# Altium schematic sheet fscv8ch.SCHDOC: 8 channel voltammetry headstage
size B; Date: 06/2016; Author: schwerdt; CompanyName: mit; : ff; DocumentName: fscv8ch
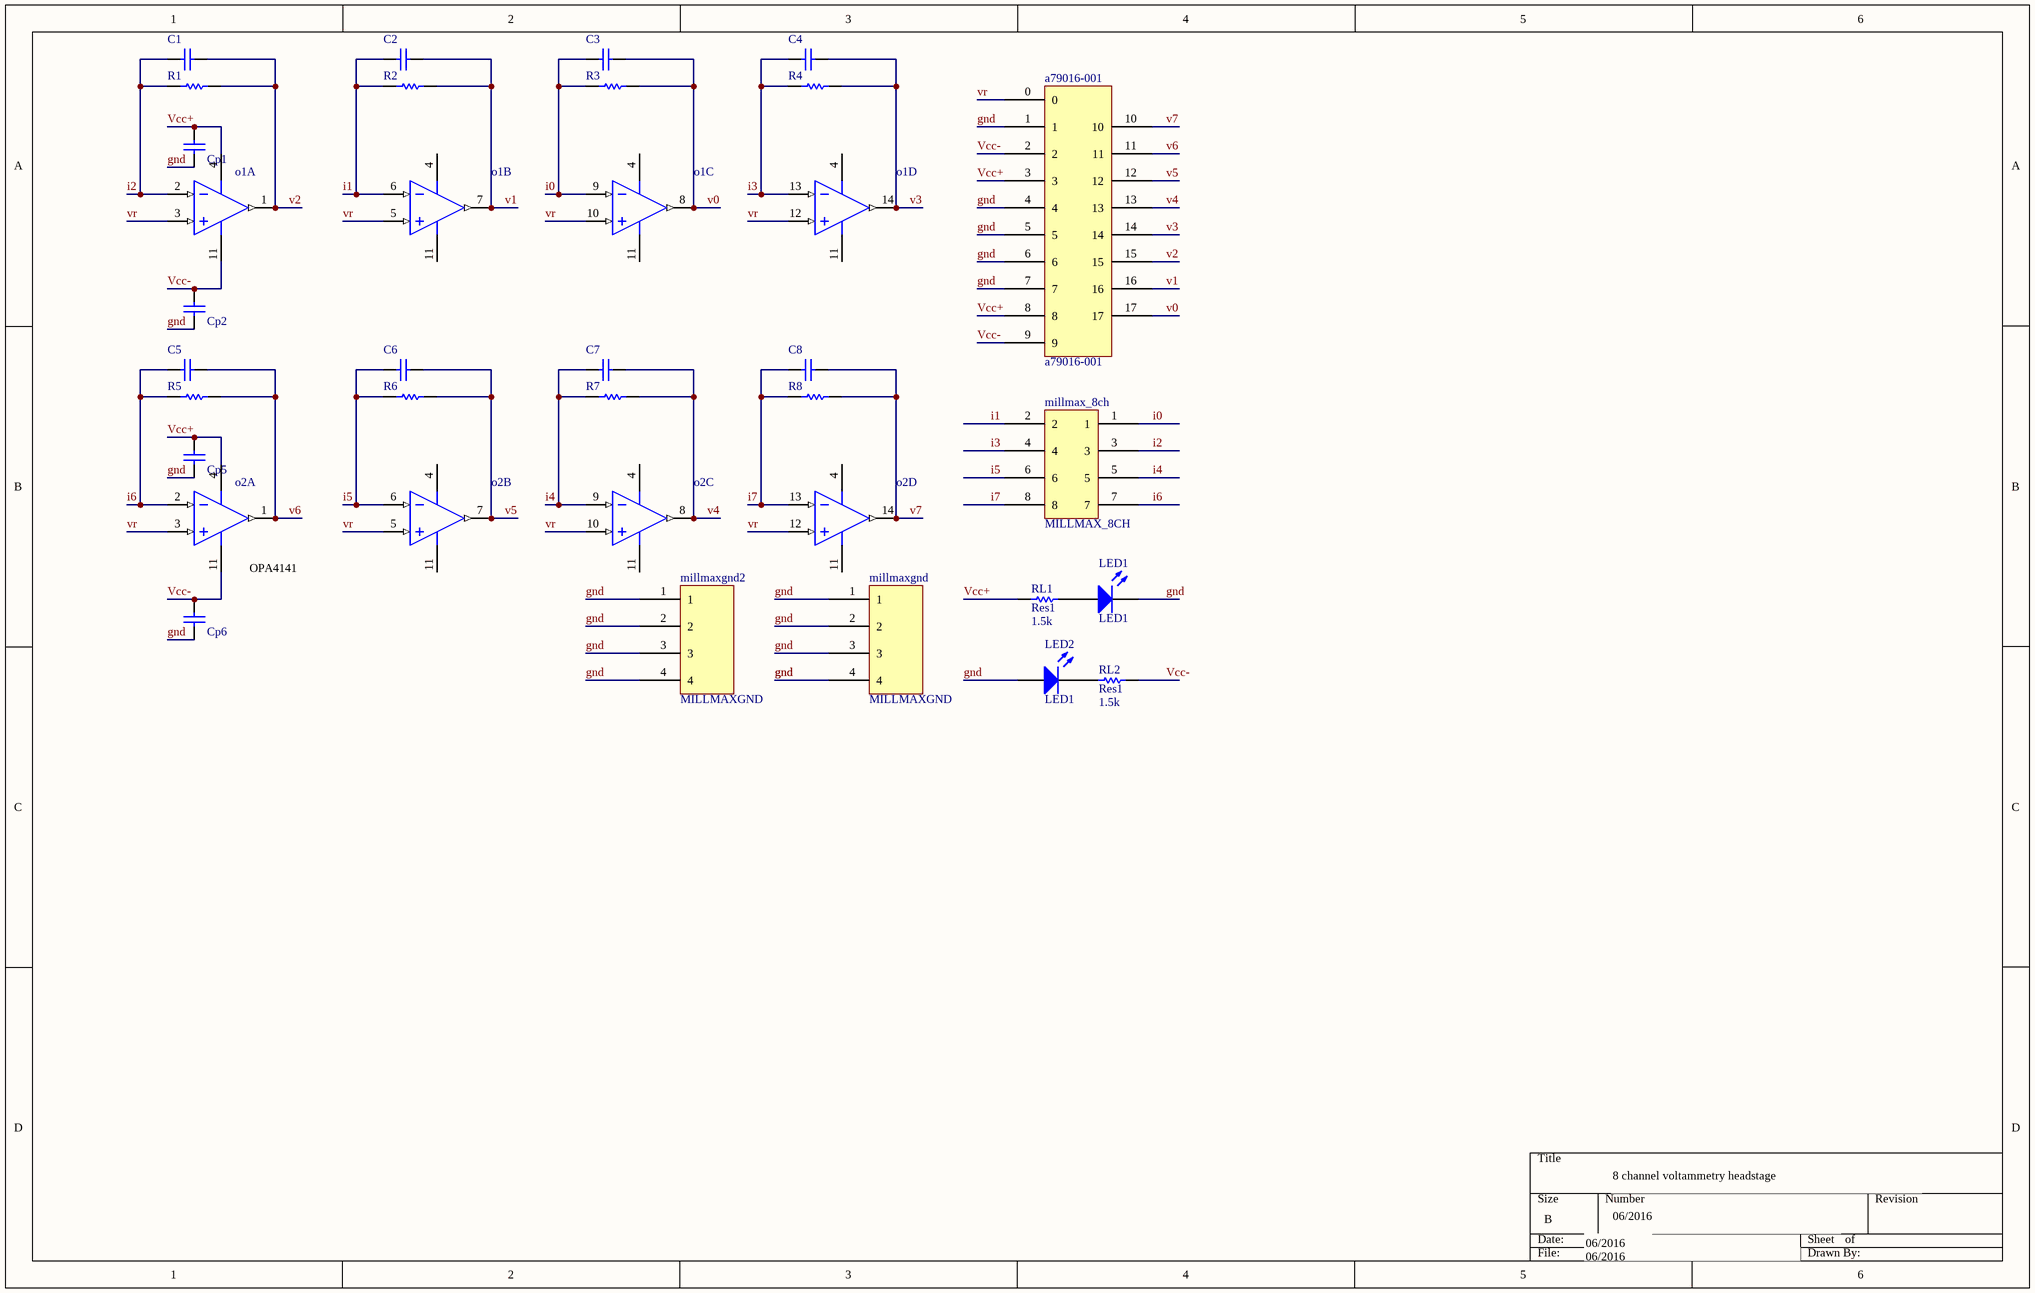
[diagram p0: fscv8ch.SCHDOC]

## Parts
a79016-001  (no value)  [A79016-001_finalnovias]
C1  Cap  [0402]  (value not drawn)
C2  Cap  [0402]  (value not drawn)
C3  Cap  [0402]  (value not drawn)
C4  Cap  [0402]  (value not drawn)
C5  Cap  [0402]  (value not drawn)
C6  Cap  [0402]  (value not drawn)
C7  Cap  [0402]  (value not drawn)
C8  Cap  [0402]  (value not drawn)
Cp1  Cap  [0402]  (value not drawn)
Cp2  Cap  [0402]  (value not drawn)
Cp5  Cap  [0402]  (value not drawn)
Cp6  Cap  [0402]  (value not drawn)
LED1  LED1  [LED_smd]
LED2  LED1  [LED_smd]
millmax_8ch  MILLMAX_8CH  [millmax833-d -8ch]
millmaxgnd  MILLMAXGND  [millmax833-43-008-20-001000gnd]
millmaxgnd2  MILLMAXGND  [millmax833-43-008-20-001000gnd]
o1  TLC274ACD  [SO-G14]  (value not drawn)  (parts A,B,C,D of 4)
o2  TLC274ACD  [SO-G14]  (value not drawn)  (parts A,B,C,D of 4)
R1  Res Semi  [0402]  (value not drawn)
R2  Res Semi  [0402]  (value not drawn)
R3  Res Semi  [0402]  (value not drawn)
R4  Res Semi  [0402]  (value not drawn)
R5  Res Semi  [0402]  (value not drawn)
R6  Res Semi  [0402]  (value not drawn)
R7  Res Semi  [0402]  (value not drawn)
R8  Res Semi  [0402]  (value not drawn)
RL1  Res1  value 1.5k  [0402]
RL2  Res1  value 1.5k  [0402]

## Nets
gnd: a79016-001.1 a79016-001.4 a79016-001.5 a79016-001.6 a79016-001.7 Cp1.1 Cp2.1 Cp5.1 Cp6.1 LED1.2(K) LED2.1(A) millmaxgnd.1 millmaxgnd.2 millmaxgnd.3 millmaxgnd.4 millmaxgnd2.1 millmaxgnd2.2 millmaxgnd2.3 millmaxgnd2.4
i0: C3.1 millmax_8ch.1 o1.9(IN-) R3.1
i1: C2.1 millmax_8ch.2 o1.6(IN-) R2.1
i2: C1.1 millmax_8ch.3 o1.2(IN-) R1.1
i3: C4.1 millmax_8ch.4 o1.13(IN-) R4.1
i4: C7.1 millmax_8ch.5 o2.9(IN-) R7.1
i5: C6.1 millmax_8ch.6 o2.6(IN-) R6.1
i6: C5.1 millmax_8ch.7 o2.2(IN-) R5.1
i7: C8.1 millmax_8ch.8 o2.13(IN-) R8.1
v0: a79016-001.17 C3.2 o1.8(OUT) R3.2
v1: a79016-001.16 C2.2 o1.7(OUT) R2.2
v2: a79016-001.15 C1.2 o1.1(OUT) R1.2
v3: a79016-001.14 C4.2 o1.14(OUT) R4.2
v4: a79016-001.13 C7.2 o2.8(OUT) R7.2
v5: a79016-001.12 C6.2 o2.7(OUT) R6.2
v6: a79016-001.11 C5.2 o2.1(OUT) R5.2
v7: a79016-001.10 C8.2 o2.14(OUT) R8.2
Vcc+: a79016-001.3 a79016-001.8 Cp1.2 Cp5.2 o1.4(V+) o2.4(V+) RL1.2
Vcc-: a79016-001.2 a79016-001.9 Cp2.2 Cp6.2 o1.11(V-) o2.11(V-) RL2.1
vr: a79016-001.0 o1.3(IN+) o1.5(IN+) o1.10(IN+) o1.12(IN+) o2.3(IN+) o2.5(IN+) o2.10(IN+) o2.12(IN+)
NetLED1_1: LED1.1(A) RL1.1
NetLED2_2: LED2.2(K) RL2.2

## Notes on the sheet
- (near o2) OPA4141
- 06/2016
- 8 channel voltammetry headstage

## Library data of the parts
a79016-001 = a79016-001
C1-C8 Cp1 Cp2 Cp5 Cp6 = Cap: Capacitor; Manufacturer: Generic Components; Class I: Passive; Value: 100pF; Published: 8-Jun-2000; Revision: July-2002: Re-released for DXP Platform.; Publisher: Altium Limited; Class II: Capacitor
LED1 LED2 = LED1: Typical RED GaAs LED; Manufacturer: Generic Components; Class I: Optoelectronic; Published: 8-Jun-2000; Revision: July-2002: Re-released for DXP Platform.; Publisher: Altium Limited; Class II: LED
o1 o2 = TLC274ACD: LinCMOS Precision Quad Operational Amplifier; Manufacturer: Texas Instruments; Package Information: Latest Revision: Jan-1998; Published: 15-Apr-2002; Datasheet: Linear Circuits Data Book 1989 Volume 1 (Aug-1988); Package Reference: D014; Publisher: Altium Limited; Class I: Amplifier; Class II: Operational Amplifier
R1-R8 = Res Semi: Semiconductor Resistor; Manufacturer: Generic Components; Class I: Passive; Value: 1K; Published: 8-Jun-2000; Revision: July-2002: Re-released for DXP Platform.; Publisher: Altium Limited; Class II: Resistor
RL1 RL2 = Res1: Resistor; Manufacturer: Generic Components; Class I: Passive; Published: 8-Jun-2000; Revision: July-2002: Re-released for DXP Platform.; Publisher: Altium Limited; Class II: Resistor